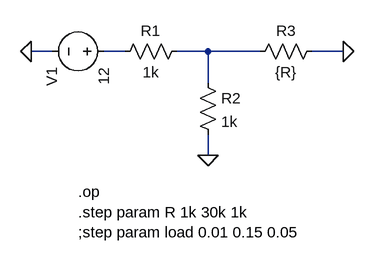
[diagram p0: schematic Dzielnik.asc]
Dzielnik.asc, the LTspice schematic file:
Version 4
SHEET 1 880 680
WIRE 48 240 16 240
WIRE 160 240 128 240
WIRE 288 240 240 240
WIRE 368 240 288 240
WIRE 496 240 448 240
WIRE 288 288 288 240
WIRE 288 400 288 368
FLAG 496 240 0
FLAG 288 400 0
FLAG 16 240 0
SYMBOL res 144 256 R270
WINDOW 0 32 56 VTop 2
WINDOW 3 0 56 VBottom 2
SYMATTR InstName R1
SYMATTR Value 1k
SYMBOL res 272 272 R0
SYMATTR InstName R2
SYMATTR Value 1k
SYMBOL voltage 144 240 R90
WINDOW 0 24 96 Left 2
WINDOW 3 24 16 Left 2
WINDOW 123 0 0 Left 0
WINDOW 39 0 0 Left 0
SYMATTR InstName V1
SYMATTR Value 12
SYMBOL res 464 224 R90
WINDOW 0 0 56 VBottom 2
WINDOW 3 32 56 VTop 2
SYMATTR InstName R3
SYMATTR Value {R}
TEXT 88 456 Left 2 !.op\n.step param R 1k 30k 1k\n;step param load 0.01 0.15 0.05

The netlist it stands for:
* Dzielnik.asc
R1 N001 N002 1k
R2 N002 0 1k
V1 N001 0 12
R3 0 N002 {R}
.op
.step param R 1k 30k 1k
;step param load 0.01 0.15 0.05
.backanno
.end